# Altium schematic sheet BlockDiagram.SchDoc: Block Diagram
size Letter; Author: Norman Chong; Organization: Midnight Sun Solar Rayce Car Team; Address1: University of Waterloo; Address2: 200 University Ave W; Address3: Waterloo, ON, Canada; Address4: N2L 3E9; Revision: 1.1; SheetNumber: 1; Website: www.uwmidsun.com
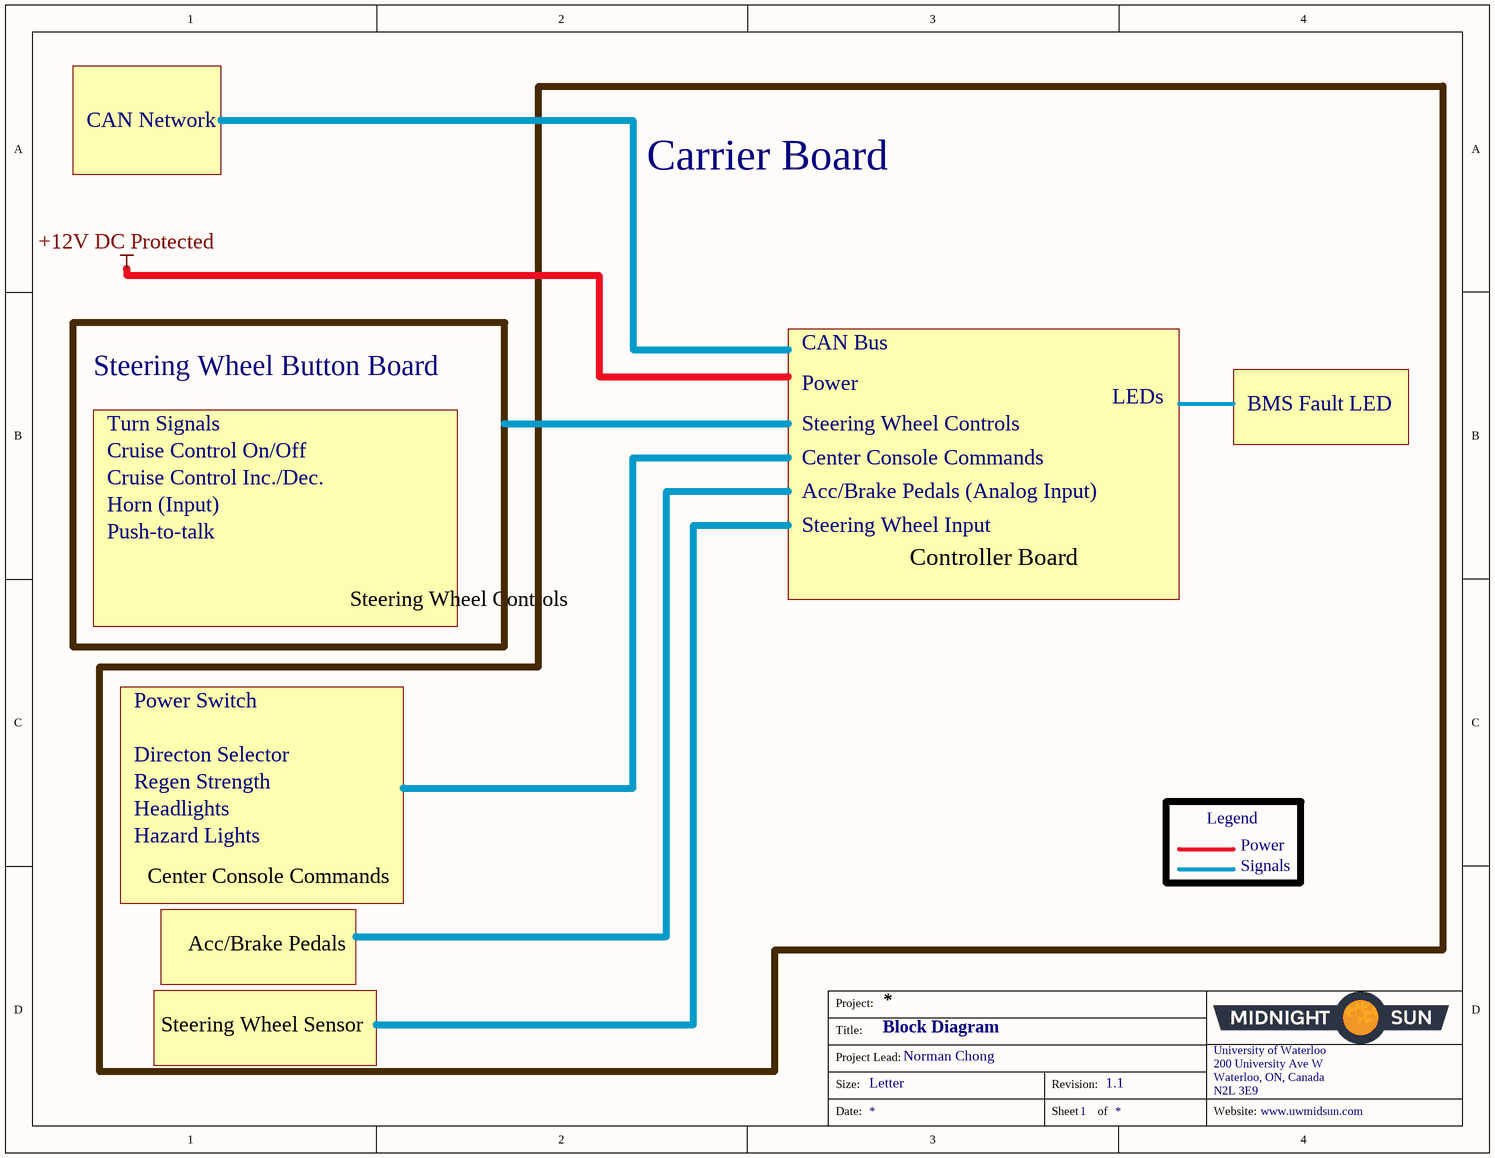
[diagram p0: BlockDiagram.SchDoc]

## Notes on the sheet
- CAN Network
- Carrier Board
- CAN Bus
- Steering Wheel Button Board
- Turn Signals
- Power
- Steering Wheel Controls
- LEDs
- BMS Fault LED
- Cruise Control Inc./Dec.
- Cruise Control On/Off
- Center Console Commands
- Acc/Brake Pedals (Analog Input)
- Horn (Input)
- Push-to-talk
- Steering Wheel Input
- Controller Board
- Power Switch
- Directon Selector
- Regen Strength
- Headlights
- Legend
- Hazard Lights
- Signals
- Acc/Brake Pedals
- Steering Wheel Sensor
- Labels drawn without touching a wire or pin: +12V DC Protected
- Project:
- Title:
- Size:
- Project Lead:
- Letter
- Revision:
- University of Waterloo
- 200 University Ave W
- Waterloo, ON, Canada
- N2L 3E9
- Date:
- Sheet
- of
- Website: